# Altium schematic sheet CtrlCarbinBoard_MCU.SchDoc
size A3
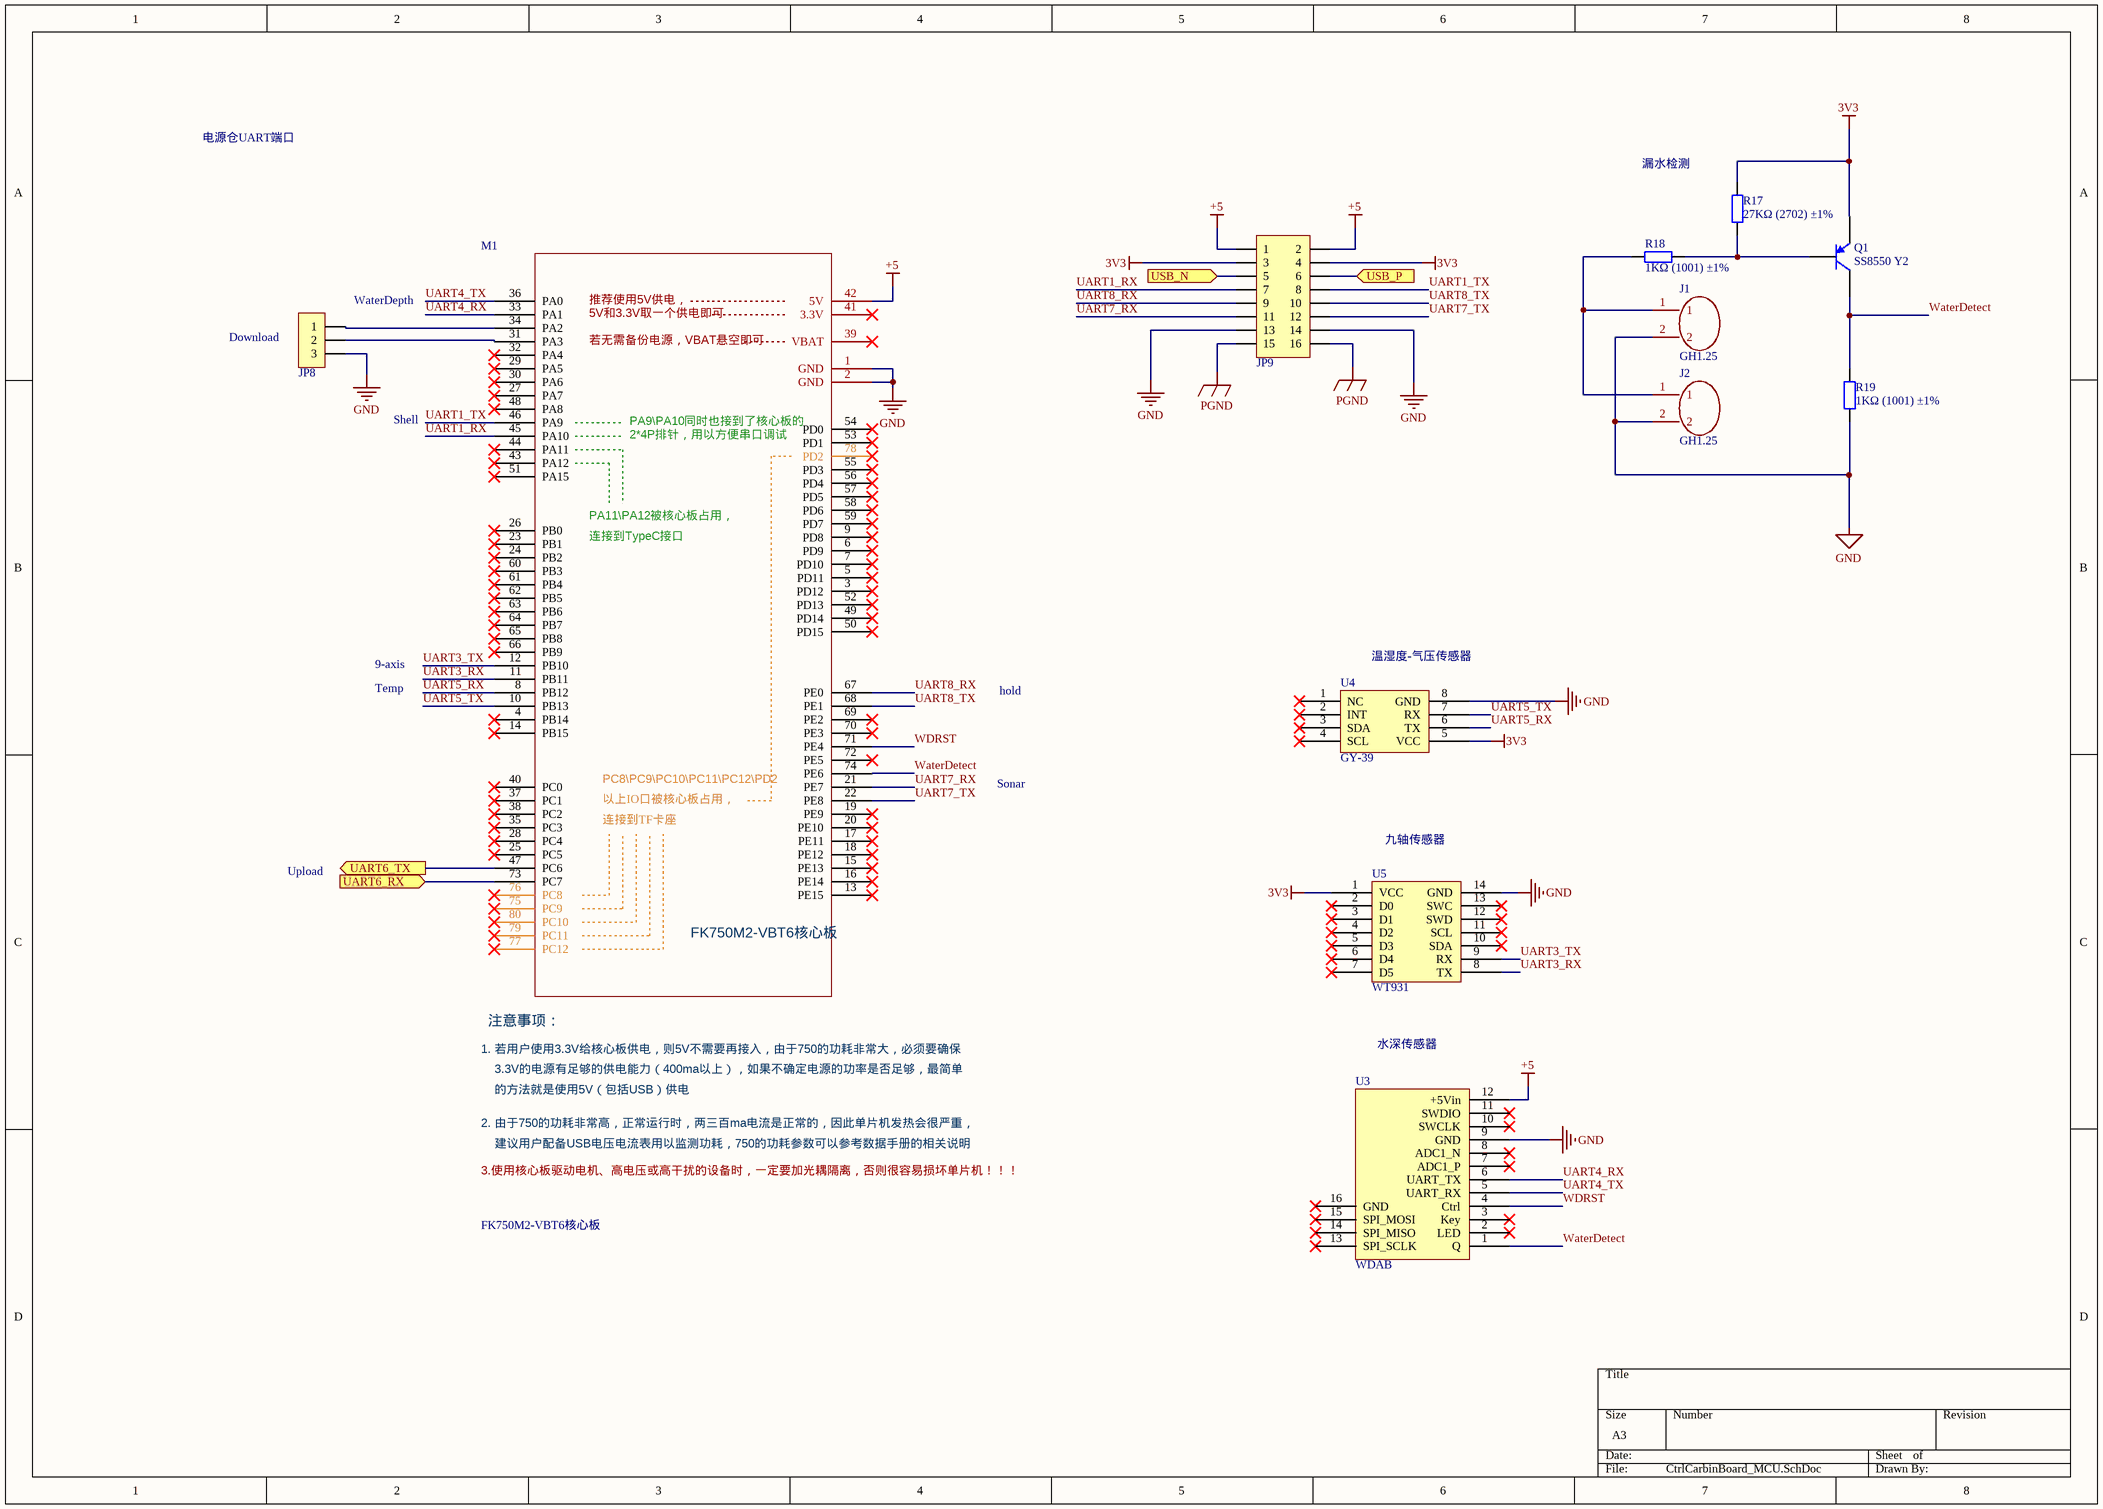
[diagram p0: CtrlCarbinBoard_MCU.SchDoc]

## Parts
J1  GH1.25  [GH1.25 2pin]
J2  GH1.25  [GH1.25 2pin]
JP8  HDR-1X3  [PH2.0-LS-3P]  (value not drawn)
JP9  Header 8X2  [IDC2.54-LI-2x8P]  (value not drawn)
M1  FK750M2-VBT6核心板  [FK750M2-VBT6(精简版)]
Q1  SS8550 Y2  [SOT-23(SOT-23-3)]
R17  27KΩ (2702) ±1%  [0603_R]
R18  1KΩ (1001) ±1%  [0603_R]
R19  1KΩ (1001) ±1%  [0603_R]
U3  WDAB  [WaterDepthBoard]
U4  GY-39  [GY39]
U5  WT931  [WT931]

## Ports
UART6_RX (in), UART6_TX (out), USB_N (in), USB_P (in)

## Nets
3V3: JP9.3 JP9.4 Q1.2(E) R17.2 U4.5(VCC) U5.1(VCC)
+5: JP9.1 JP9.2 M1.42(5V) U3.12(+5Vin)
GND: J1.2 J2.2 JP8.3 JP9.13 JP9.14 M1.1(GND) M1.2(GND) R19.1 U3.9(GND) U4.8(GND) U5.14(GND)
PGND: JP9.15 JP9.16
UART1_RX: JP9.7 M1.45(PA10)
UART1_TX: JP9.8 M1.46(PA9)
UART3_RX: M1.11(PB11) U5.8(TX)
UART3_TX: M1.12(PB10) U5.9(RX)
UART4_RX: M1.33(PA1) U3.6(UART_TX)
UART4_TX: M1.36(PA0) U3.5(UART_RX)
UART5_RX: M1.8(PB12) U4.6(TX)
UART5_TX: M1.10(PB13) U4.7(RX)
UART6_RX: M1.73(PC7) ; port UART6_RX
UART6_TX: M1.47(PC6) ; port UART6_TX
UART7_RX: JP9.11 M1.21(PE7)
UART7_TX: JP9.12 M1.22(PE8)
UART8_RX: JP9.9 M1.67(PE0)
UART8_TX: JP9.10 M1.68(PE1)
USB_N: JP9.5 ; port USB_N
USB_P: JP9.6 ; port USB_P
WaterDetect: M1.74(PE6) Q1.3(C) R19.2 U3.1(Q)
WDRST: M1.71(PE4) U3.4(Ctrl)
NetJ1_1: J1.1 J2.1 R18.1
NetJP8_1: JP8.1 M1.34(PA2)
NetJP8_2: JP8.2 M1.31(PA3)
NetQ1_1: Q1.1(B) R17.1 R18.2

Not connected (* = marked no-connect by the designer): M1 3(PD12)* 4(PB14)* 5(PD11)* 6(PD9)* 7(PD10)* 9(PD8)* 13(PE15)* 14(PB15)* 15(PE13)* 16(PE14)* 17(PE11)* 18(PE12)* 19(PE9)* 20(PE10)* 23(PB1)* 24(PB2)* 25(PC5)* 26(PB0)* 27(PA7)* 28(PC4)* 29(PA5)* 30(PA6)* 32(PA4)* 35(PC3)* 37(PC1)* 38(PC2)* 39(VBAT)* 40(PC0)* 41(3.3V)* 43(PA12)* 44(PA11)* 48(PA8)* 49(PD14)* 50(PD15)* 51(PA15)* 52(PD13)* 53(PD1)* 54(PD0)* 55(PD3)* 56(PD4)* 57(PD5)* 58(PD6)* 59(PD7)* 60(PB3)* 61(PB4)* 62(PB5)* 63(PB6)* 64(PB7)* 65(PB8)* 66(PB9)* 69(PE2)* 70(PE3)* 72(PE5)* 75(PC9)* 76(PC8)* 77(PC12)* 78(PD2)* 79(PC11)* 80(PC10)*; U3 2(LED)* 3(Key)* 7(ADC1_P)* 8(ADC1_N)* 10(SWCLK)* 11(SWDIO)* 13(SPI_SCLK)* 14(SPI_MISO)* 15(SPI_MOSI)* 16(GND)*; U4 1(NC)* 2(INT)* 3(SDA)* 4(SCL)*; U5 2(D0)* 3(D1)* 4(D2)* 5(D3)* 6(D4)* 7(D5)* 10(SDA)* 11(SCL)* 12(SWD)* 13(SWC)*

## Notes on the sheet
- 电源仓UART端口
- 漏水检测
- (near JP8) WaterDepth
- (near JP8) Download
- Shell
- 9-axis
- Temp
- hold
- (near U4) 温湿度-气压传感器
- Sonar
- (near U5) 九轴传感器
- Upload
- 水深传感器
- (in symbol FK750M2-VBT6) 推荐使用5V供电，; 5V和3.3V取一个供电即可; 若无需备份电源，VBAT悬空即可; PA9\PA10同时也接到了核心板的; 2*4P排针，用以方便串口调试; PA11\PA12被核心板占用，; 连接到TypeC接口; PC8\PC9\PC10\PC11\PC12\PD2; 以上IO口被核心板占用，; 连接到TF卡座; 注意事项：; 1. 若用户使用3.3V给核心板供电，则5V不需要再接入，由于750的功耗非常大，必须要确保; 3.3V的电源有足够的供电能力（400ma以上），如果不确定电源的功率是否足够，最简单; 的方法就是使用5V（包括USB）供电; 2. 由于750的功耗非常高，正常运行时，两三百ma电流是正常的，因此单片机发热会很严重，; 建议用户配备USB电压电流表用以监测功耗，750的功耗参数可以参考数据手册的相关说明; 3.使用核心板驱动电机、高电压或高干扰的设备时，一定要加光耦隔离，否则很容易损坏单片机！！！

## Library data of the parts
J1 J2 = GH1.25 2pin
JP8 = Header 3: 3P接插件; 版权归属: 源创客; BOM名称: 3P接插件; 学习资源: www.ooocke.com
JP9 = Header 8X2: 8*2P接插件; 版权归属: 源创客; BOM名称: 8*2P接插件; 学习资源: www.ooocke.com
M1 = FK750M2-VBT6
Q1 = SOT-23 SS8550 Y2: 三极管; ComponentLink1Description: 供应商链接; ComponentLink1URL: http://www.szlcsc.com/product/details_9037.html; Package: SOT-23; Supplier: LC; SuppliersPartNumber: C8542
R17 = 0603 27KΩ (2702) 1%: 贴片电阻; ComponentLink1Description: 供应商链接; ComponentLink1URL: http://www.szlcsc.com/product/details_23694.html; Package: 0603; Supplier: LC; SuppliersPartNumber: C22967
R18 R19 = 0603 1KΩ (1001) 1%: 贴片电阻; ComponentLink1Description: 供应商链接; ComponentLink1URL: http://www.szlcsc.com/product/details_21904.html; Package: 0603; Supplier: LC; SuppliersPartNumber: C21190
U3 = WaterDepthBoard
U4 = GY39: GY39温湿度大气压光照传感器
U5 = WT931: 维特智能WT931九轴模块